# EAGLE design Singularitron Enviro-Module v1 (EAGLE 7.3.0)
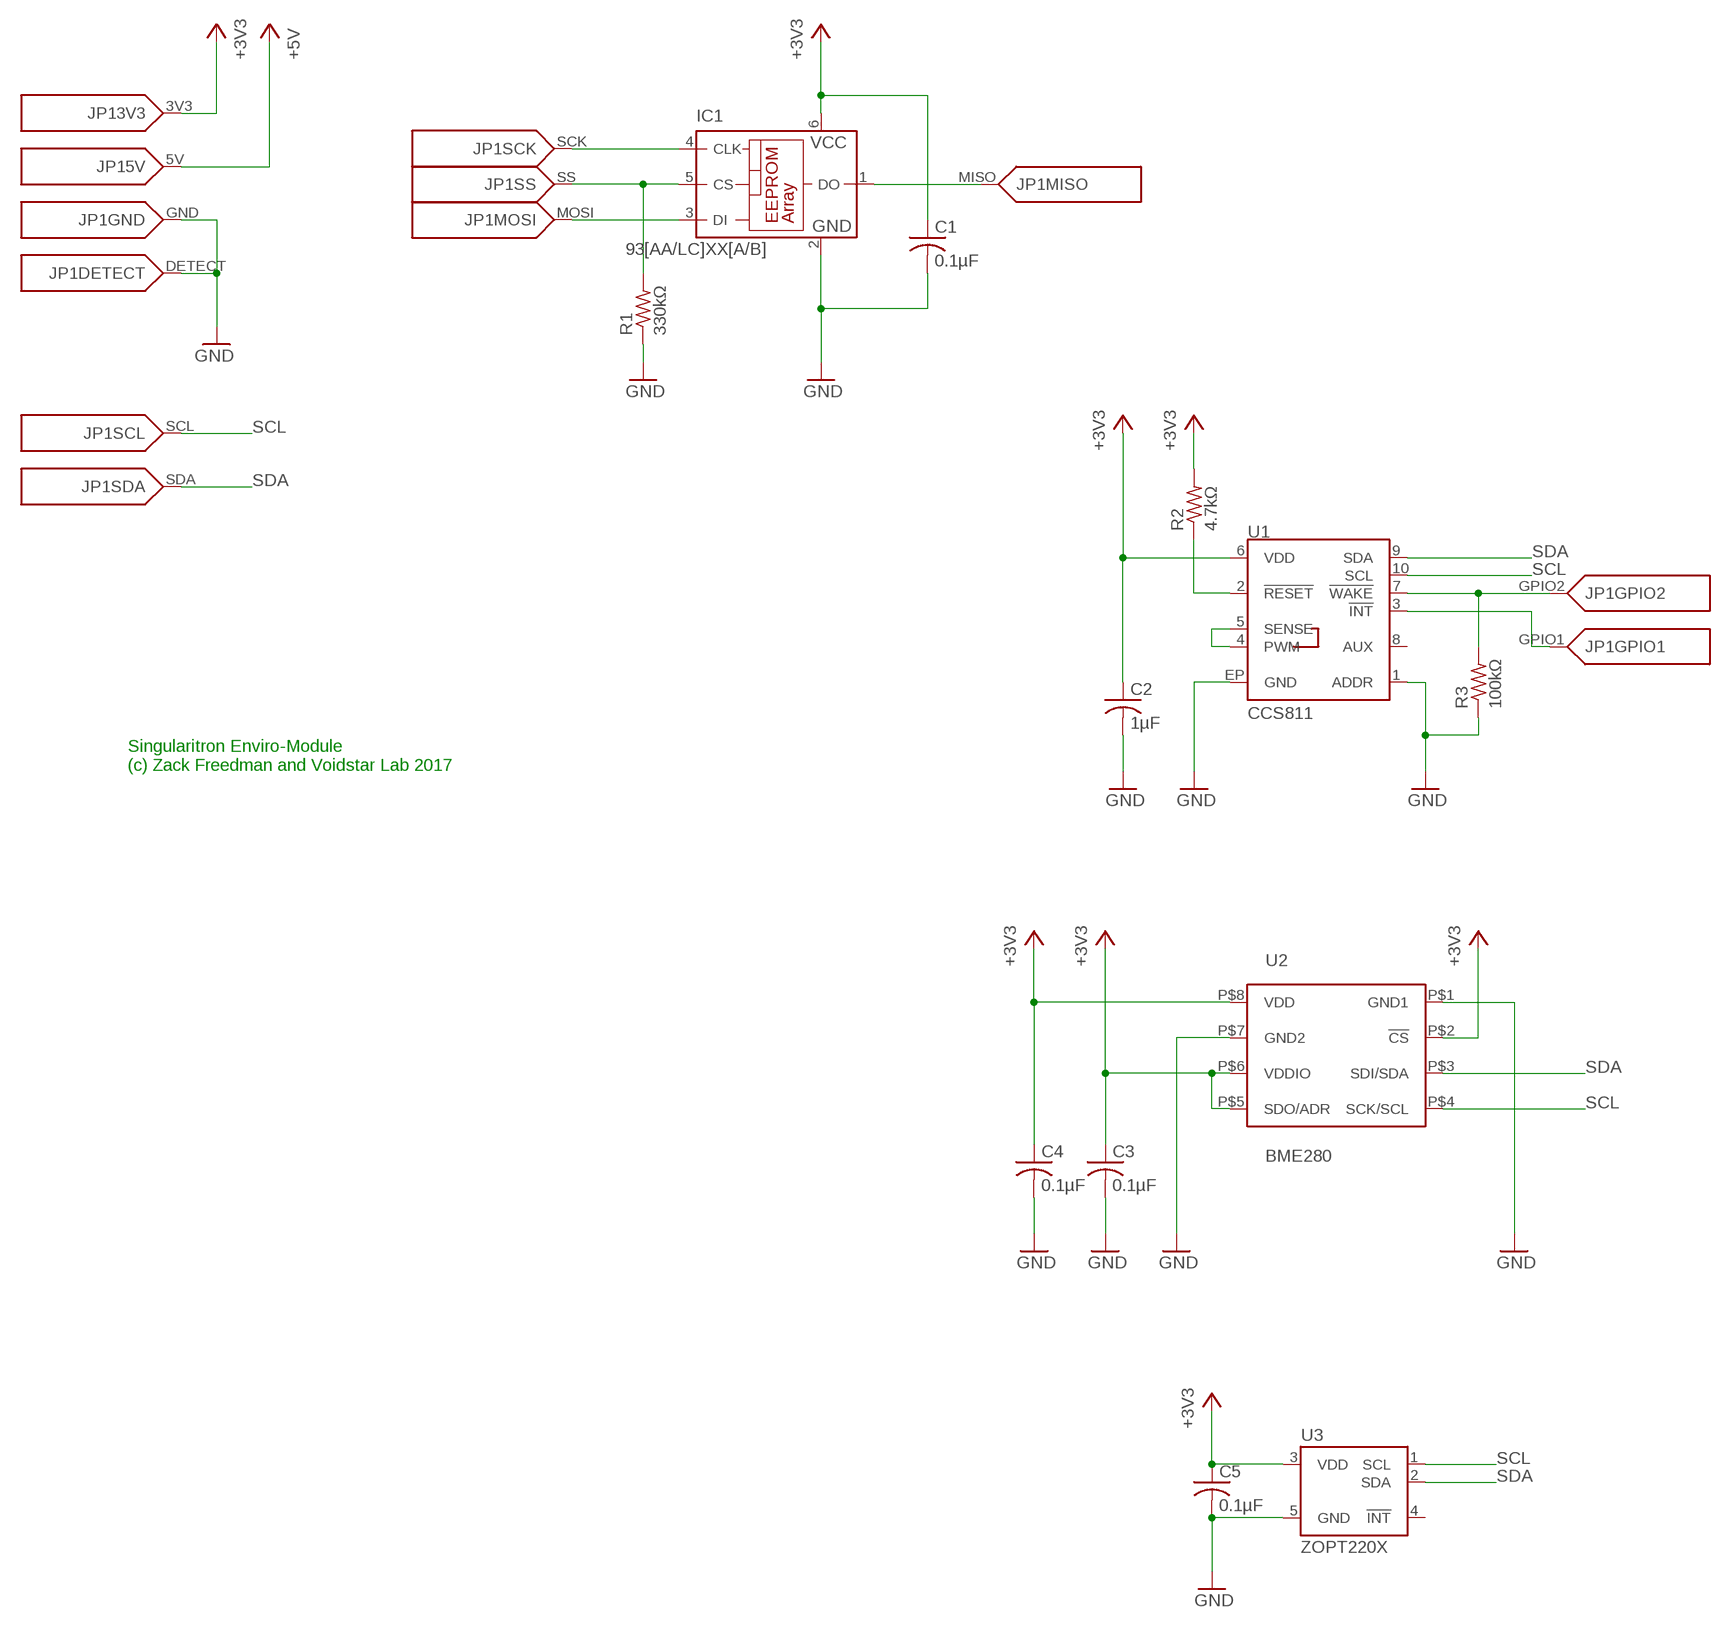
[diagram p0: schematic, sheet 1]

## Parts
C1  0.1µF  C-USC0603  [C0603]
C2  1µF  C-USC0603  [C0603]
C3  0.1µF  C-USC0603  [C0603]
C4  0.1µF  C-USC0603  [C0603]
C5  0.1µF  C-USC0603  [C0603]
IC1  93[AA/LC]XX[A/B]  93AA76A  [SOT23-6]
JP1  SINGULARITRON_CART_BASE  [SINGULARITRON_CART_BASE]
R1  330kΩ  R-US_R0603  [R0603]
R2  4.7kΩ  R-US_R0603  [R0603]
R3  100kΩ  R-US_R0603  [R0603]
U1  CCS811  [LGA10]
U2  BME280  [BME280_LGA]
U3  ZOPT220X  [LGA6]

## Nets
+3V3: C1.1 C2.1 C3.1 C4.1 C5.1 IC1.6(VCC) JP1.3V3 R2.2 U1.6(VDD) U2.P$2(!CS) U2.P$5(SDO/ADR) U2.P$6(VDDIO) U2.P$8(VDD) U3.3(VDD)
+5V: JP1.5V
GND: C1.2 C2.2 C3.2 C4.2 C5.2 IC1.2(GND) JP1.DETECT JP1.GND R1.1 R3.1 U1.1(ADDR) U1.EP(GND) U2.P$1(GND1) U2.P$7(GND2) U3.5(GND)
N$1: IC1.5(CS) JP1.SS R1.2
N$5: IC1.4(CLK) JP1.SCK
N$6: IC1.3(DI) JP1.MOSI
N$7: IC1.1(DO) JP1.MISO
N$8: R2.1 U1.2(!RESET!)
N$9: JP1.GPIO2 R3.2 U1.7(!WAKE!)
N$13: JP1.GPIO1 U1.3(!INT!)
N$14: U1.4(PWM) U1.5(SENSE)
SCL: JP1.SCL U1.10(SCL) U2.P$4(SCK/SCL) U3.1(SCL)
SDA: JP1.SDA U1.9(SDA) U2.P$3(SDI/SDA) U3.2(SDA)
Unconnected: U1.8(AUX) U3.4(!INT)

## Notes on the sheet
- Singularitron Enviro-Module
  (c) Zack Freedman and Voidstar Lab 2017

## Library data of the parts
C1-C5 = rcl:C-US: CAPACITOR, American symbol
IC1 = microchip:93*76?: 8K Microwire Compatible Serial EEPROM Source: http://ww1.microchip.com/downloads/en/DeviceDoc/21796H.pdf; MPN: 93AA76AT-I/OT; OC_FARNELL: 1331443; OC_NEWARK: 35M2481
JP1 = Voidstar-Exotic:SINGULARITRON_CART_BASE
R1-R3 = rcl:R-US_: RESISTOR, American symbol
U1 = CCS811_Breakout_Temp:CCS811: AMS CCS811 – I2C Digital Gas Sensor Ultra-Low Power Digital Gas Sensor for Monitoring Indoor Air Quality AMS Product Page <http://ams.com/eng/Products/Environmental-Sensors/Gas-Sensors/CCS811> SparkFun Products:; PROD_ID: IC-13607
U2 = BME280ComponentLibrary:BME280; PROD_ID: IC-13090
U3 = SparkX:ZOPT220X

## Board
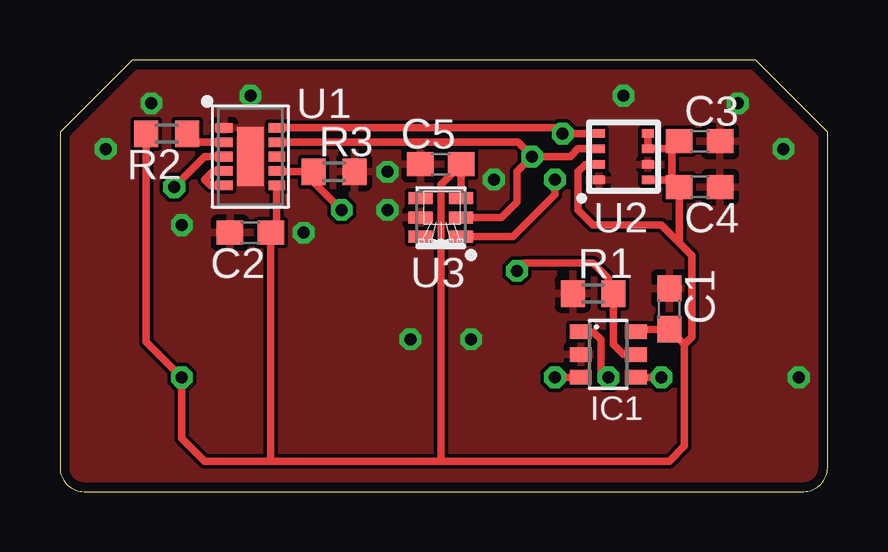
[diagram p1: board, top side]
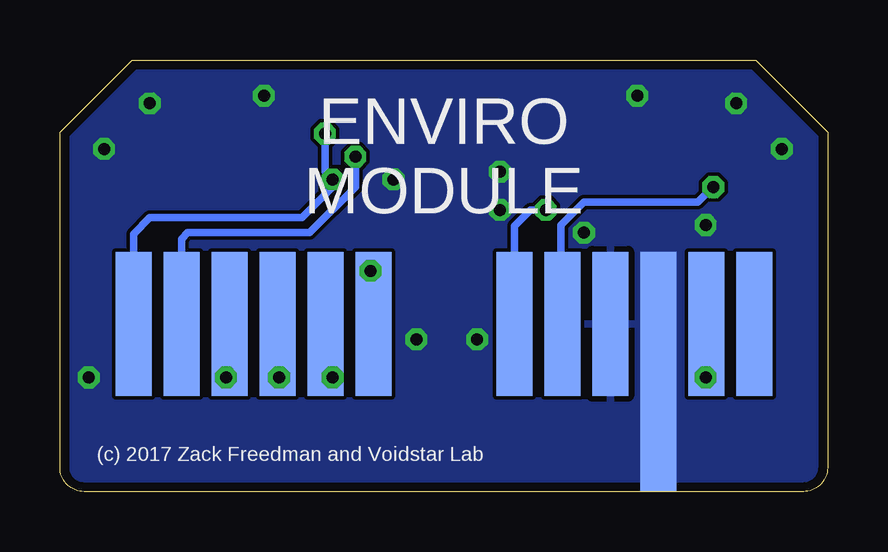
[diagram p2: board, bottom side, seen from below]

Size 32 x 18 mm. Coordinates in mm from the lower left corner, seen from the top.
Outline: 29,18 3,18 0,15 0,1 arc90 1,0 31,0 arc90 32,1 32,15 29,18
Copper layers (1*16): Top 0.035559375mm / dielectric 1.501140625mm / Bottom 0.035559375mm
Design rules "typical_4pcb *": minimum track width 10mil, minimum drill 15mil, track to track 6mil, track to pad 6mil, pad to pad 6mil, via to via 6mil, smd to smd 6mil, copper to edge 15mil, drill to drill 8mil, minimum pad ring 10mil, minimum via ring 8mil, stop-mask expansion 4mil, vias tented up to drill 20mil, thermal gap 10mil

### Footprints (pad centres in the part's own frame; a part is rotated, then mirrored left to right if it is on the bottom)
C0603 = smd 1.1 x 1: 1 -0.85,0; 2 0.85,0
SOT23-6 = smd 0.6 x 0.9: 1 -0.95,-1.15; 2 0,-1.15; 3 0.95,-1.15; 4 0.95,1.15; 5 0,1.15; 6 -0.95,1.15
SINGULARITRON_CART_BASE = smd 1.5 x 6 bottom: 3V3 5.062,7; 5V 3.062,7; DETECT 9.062,7; GPIO1 11.062,7; GPIO2 13.062,7; MISO 22.938,7; MOSI 20.938,7; SCK 24.938,7; SCL 28.938,7; SDA 26.938,7; SS 18.938,7 | smd 1.5 x 10 bottom: GND 7.062,5
R0603 = smd 1 x 1.1: 1 -0.85,0; 2 0.85,0
LGA10 = smd 0.7 x 0.4: 1 -1.1,1.2; 2 -1.1,0.6; 3 -1.1,0; 4 -1.1,-0.6; 5 -1.1,-1.2; 6 1.1,-1.2; 7 1.1,-0.6; 8 1.1,0; 9 1.1,0.6; 10 1.1,1.2 | smd 1.1 x 2.45: EP 0,0
BME280_LGA = smd 0.5 x 0.35: P$1 1.025,0.975; P$2 1.025,0.325; P$3 1.025,-0.325; P$4 1.025,-0.975; P$5 -1.025,-0.975; P$6 -1.025,-0.325; P$7 -1.025,0.325; P$8 -1.025,0.975
LGA6 = smd 0.5 x 1: 1 -0.8,-0.85; 2 0,-0.85; 3 0.8,-0.85; 4 0.8,0.85; 5 0,0.85; 6 -0.8,0.85

### Placement (x,y rotation side)
C1  25.4,7.62 90 top
C2  7.94,10.79 180 top
C3  26.67,14.61 0 top
C4  26.67,12.7 0 top
C5  15.88,13.65 180 top
IC1  22.86,5.71 270 top
JP1  0,0 0 top
R1  22.23,8.26 0 top
R2  4.45,14.92 180 top
R3  11.43,13.34 180 top
U1  7.94,13.97 0 top
U2  23.5,13.97 180 top
U3  15.88,11.43 90 top

### Tracks (layer width: path | path; a pad name or v marks a point on that pad's centre or on a via)
+3V3  (via drill 0.5)
  Top 0.305: IC1.6 24.11,6.77 C1.1 26.04,6.13 | 8.89,1.27 6.03,1.27 5.08,2.22 v5.08,4.76 3.6,6.25 R2.2 | 8.89,1.27 15.88,1.27 | 15.88,1.27 25.4,1.27 26.04,1.91 26.04,6.13 | U1.6 9.04,10.79 C2.1 8.79,1.37 8.89,1.27 | C3.1 25.51,14.29 | 25.51,14.29 U2.P$6 U2.P$5 | C4.1 25.52,12.99 U2.P$8 | U2.P$2 21.9,13.64 21.59,13.34 21.59,11.75 22.23,11.11 25.08,11.11 25.82,10.38 | 26.04,6.13 26.35,6.45 26.35,9.84 25.82,10.38 | 25.51,14.29 25.51,13.01 C4.1 | C4.1 25.82,10.38 | U3.3 C5.1 15.88,12.8 15.88,1.27
  Bottom 0.305: JP1.3V3 5.08,6.98 v5.08,4.76
GND  (via drill 0.5)
  other vias: 5.08,11.11 3.81,16.19 28.26,16.19 30.16,14.29 1.91,14.29 13.65,13.34 23.5,16.51 7.94,16.51 17.14,6.35 30.8,4.76 13.65,11.75 10.16,10.79 14.61,6.35 18.1,13.02
  pour Top: 0,0 0,19.05 33.02,19.05 33.02,0
  pour Bottom: 0,0 0,19.05 33.02,19.05 33.02,0
N$1  (via drill 0.5)
  Top 0.305: v19.05,9.21 19.37,9.53 22.23,9.53 22.86,8.89 22.86,8.47 R1.2 23.07,6.13 23.5,5.71 IC1.5
  Bottom 0.305: JP1.SS 18.94,9.1 v19.05,9.21
N$5  (via drill 0.5)
  Top 0.305: IC1.4 v25.08,4.76
  Bottom 0.305: JP1.SCK 24.94,4.91 v25.08,4.76
N$6  (via drill 0.5)
  Top 0.305: IC1.3 v20.64,4.76
  Bottom 0.305: JP1.MOSI 20.94,5.06 v20.64,4.76
N$7  (via drill 0.5)
  Top 0.305: IC1.1 22.23,6.67 22.54,6.35 22.54,5.08 v22.86,4.76
  Bottom 0.305: JP1.MISO 22.86,6.92 v22.86,4.76
N$8
  Top 0.305: U1.2 5.65,14.57 R2.1
N$9  (via drill 0.5)
  Top 0.305: U1.7 9.07,13.34 R3.2 10.58,12.91 v11.75,11.75
  Bottom 0.305: JP1.GPIO2 13.06,11.07 12.38,11.75 v11.75,11.75
N$13  (via drill 0.5)
  Top 0.305: v4.76,12.7 6.03,13.97 U1.3
  Bottom 0.305: v4.76,12.7 5.4,12.06 10.16,12.06 11.11,11.11 11.11,9.21 11.43,8.89 11.43,7.37 JP1.GPIO1
N$14
  Top 0.305: U1.5 6.28,12.77 6.03,13.02 6.38,13.37 U1.4
SCL  (via drill 0.5)
  Top 0.305: U2.P$4 22.45,14.92 v20.95,14.92 20.71,15.17 U1.10 | U3.1 18.89,10.63 20.64,12.38 v20.64,13.02
  Bottom 0.305: JP1.SCL 28.94,10.75 28.26,11.43 21.91,11.43 20.64,12.7 v20.64,13.02 20.95,13.34 v20.95,14.92
SDA  (via drill 0.5)
  Top 0.305: v19.68,13.97 21.27,13.97 21.6,14.29 U2.P$3 | v19.68,13.97 19.09,14.57 U1.9 | U3.2 18.41,11.43 19.05,12.06 19.05,13.34 v19.68,13.97
  Bottom 0.305: JP1.SDA 26.94,10.53 26.67,10.79 21.59,10.79 19.68,12.7 v19.68,13.97

### Text on the board
bPlace: ENVIRO / MODULE | (c) 2017 Zack Freedman and Voidstar Lab